# Altium schematic sheet ABA-52563-SCH.SchDoc
size A4
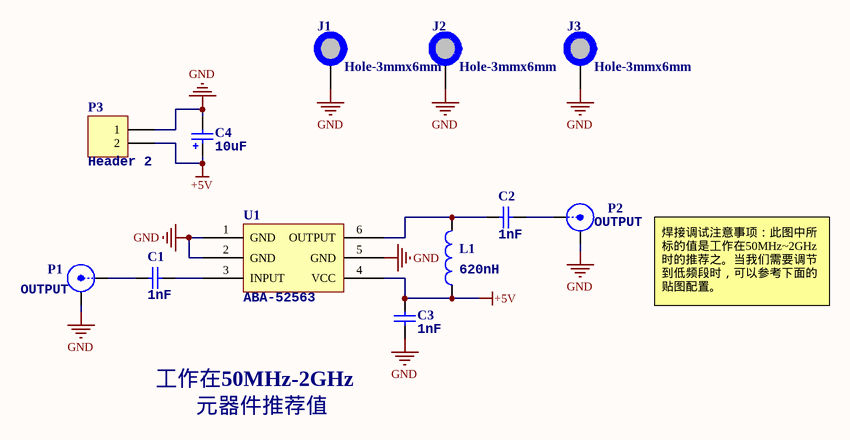
[diagram p0: ABA-52563-SCH.SchDoc]

## Parts
C1  1nF  [0603C]
C2  1nF  [0603C]
C3  1nF  [0603C]
C4  10uF  [1206T]
J1  Hole-3mmx6mm  [Hole]
J2  Hole-3mmx6mm  [Hole]
J3  Hole-3mmx6mm  [Hole]
L1  620nH  [0603L]
P1  OUTPUT  [SMA-SMD]
P2  OUTPUT  [SMA-SMD]
P3  Header 2  [KF2EDG_3R81_2P]
U1  ABA-52563  [SOT23-6]

## Nets
+5V: C3.1 C4.1(+) L1.1 P3.2 U1.4(VCC)
GND: C3.2 C4.2(-) J1.0 J2.0 J3.0 P1.2(Y) P2.2(Y) P3.1 U1.1(GND) U1.2(GND) U1.5(GND)
NetC1_1: C1.1 P1.1(X)
NetC1_2: C1.2 U1.3(INPUT)
NetC2_1: C2.1 L1.2 U1.6(OUTPUT)
NetC2_2: C2.2 P2.1(X)

## Notes on the sheet
- 焊接调试注意事项：此图中所标的值是工作在50MHz~2GHz时的推荐之。当我们需要调节到低频段时，可以参考下面的贴图配置。
- 工作在50MHz-2GHz
- 元器件推荐值

## Library data of the parts
C1-C3 = Cap1: CAP CER 10000PF 100V X7R 0603; Manufacturer: TDK Corporation; Manufacturer Part Number: C1608X7R2A103K080AA; Tolerance: ±10%; Notification: Current market demand for these product types have resulted in fluctuating and extending lead times. Lead times may differ.; Supplier 1: Digi-Key; RoHS: RoHS Compliant; Category: Capacitors; Stock 1: 40000; Pricing 1: 4000=0.01438 (USD); Packaging: Tape & Reel (TR); Part Status: Active; Voltage - Rated: 100V; Temperature Coefficient: X7R; Operating Temperature: -55°C ~ 125°C; Features: -; Ratings: -; Applications: General Purpose; Failure Rate: -; Mounting Type: Surface Mount, MLCC; Package / Case: 0603 (1608 Metric); Size / Dimension: 0.063" L x 0.032" W (1.60mm x 0.80mm); Height - Seated (Max): -; Thickness (Max): 0.035" (0.90mm); Lead Spacing: -; Lead Style: -; ComponentLink1URL: https://product.tdk.com/info/en/catalog/datasheets/mlcc_commercial_midvoltage_en.pdf; ComponentLink1Description: https://product.tdk.com/info/en/catalog/datasheets/mlcc_commercial_midvoltage_en.pdf; Supplier Part Number 1: 445-1304-2-ND; Value: 1nF
C4 = Cap2: CAP TANT 10UF 10V 10% 1206; Manufacturer: KEMET; Manufacturer Part Number: T491A106K010AT7280; Manufacturer Size Code: A; Type: Molded; ESR (Equivalent Series Resistance): 3.8 Ohm; Lifetime @ Temp.: 2000 Hrs @ 125°C; Notification: Current market demand for these product types have resulted in fluctuating and extending lead times. Lead times may differ.; Supplier 1: Digi-Key; RoHS: RoHS Compliant; Category: Capacitors; Stock 1: 27000; Pricing 1: 9000=0.084, 18000=0.08138, 27000=0.07875, 63000=0.0735 (USD); Packaging: Tape & Reel (TR); Part Status: Active; Tolerance: ±10%; Operating Temperature: -55°C ~ 125°C; Mounting Type: Surface Mount; Package / Case: 1206 (3216 Metric); Size / Dimension: 0.126" L x 0.063" W (3.20mm x 1.60mm); Height - Seated (Max): 0.071" (1.80mm); Lead Spacing: -; Features: General Purpose; Failure Rate: -; ComponentLink1URL: https://api.kemet.com/component-edge/download/datasheet/T491A106K010AT7280.pdf; ComponentLink1Description: https://api.kemet.com/component-edge/download/datasheet/T491A106K010AT7280.pdf; Supplier Part Number 1: 399-8268-2-ND; Value: 10uF
J1-J3 = HOLED
L1 = Inductors: FIXED IND 240NH 4.4A 22MOHM SMD; Manufacturer: Samsung Electro-Mechanics; Manufacturer Part Number: CIGT201210UHR24MNE; Type: Thin Film; Material - Core: Metal Composite; Tolerance: ±20%; Current - Saturation: 6.6A; Shielding: Unshielded; DC Resistance (DCR): 22 mOhm Max; Supplier 1: Digi-Key; RoHS: RoHS Compliant; Category: Inductors, Coils, Chokes; Stock 1: 17555; Pricing 1: 1=0.26, 10=0.23, 100=0.1579, 500=0.13492, 1000=0.10334 (USD); Packaging: Cut Tape (CT); Part Status: Active; Q @ Freq: -; Frequency - Self Resonant: -; Ratings: -; Operating Temperature: -40°C ~ 125°C; Features: -; Mounting Type: Surface Mount; Package / Case: 0805 (2012 Metric); Supplier Device Package: 0603 (1608 Metric); Size / Dimension: 0.079" L x 0.049" W (2.00mm x 1.25mm); Height - Seated (Max): 0.039" (1.00mm); ComponentLink1URL: http://www.samsungsem.com/kr/support/product-search/inductor/CIGT201210UHR24MNE.jsp; ComponentLink1Description: http://www.samsungsem.com/kr/support/product-search/inductor/CIGT201210UHR24MNE.jsp; Supplier Part Number 1: 1276-6890-1-ND; Value: 620nH
P1 P2 = BNC: BNC Elbow Connector; LatestRevisionDate: 17-Jul-2002; LatestRevisionNote: Re-released for DXP Platform.; Publisher: Altium Limited
P3 = Header 2: Header, 2-Pin; LatestRevisionDate: 17-Jul-2002; LatestRevisionNote: Re-released for DXP Platform.; Publisher: Altium Limited
U1 = ABA-52563: Agilent ABA-52563  3.5 GHz Broadband Silicon  RFIC Amplifier